# EAGLE schematic Boomchak (EAGLE 5.11)

## Sheet 1 of 3
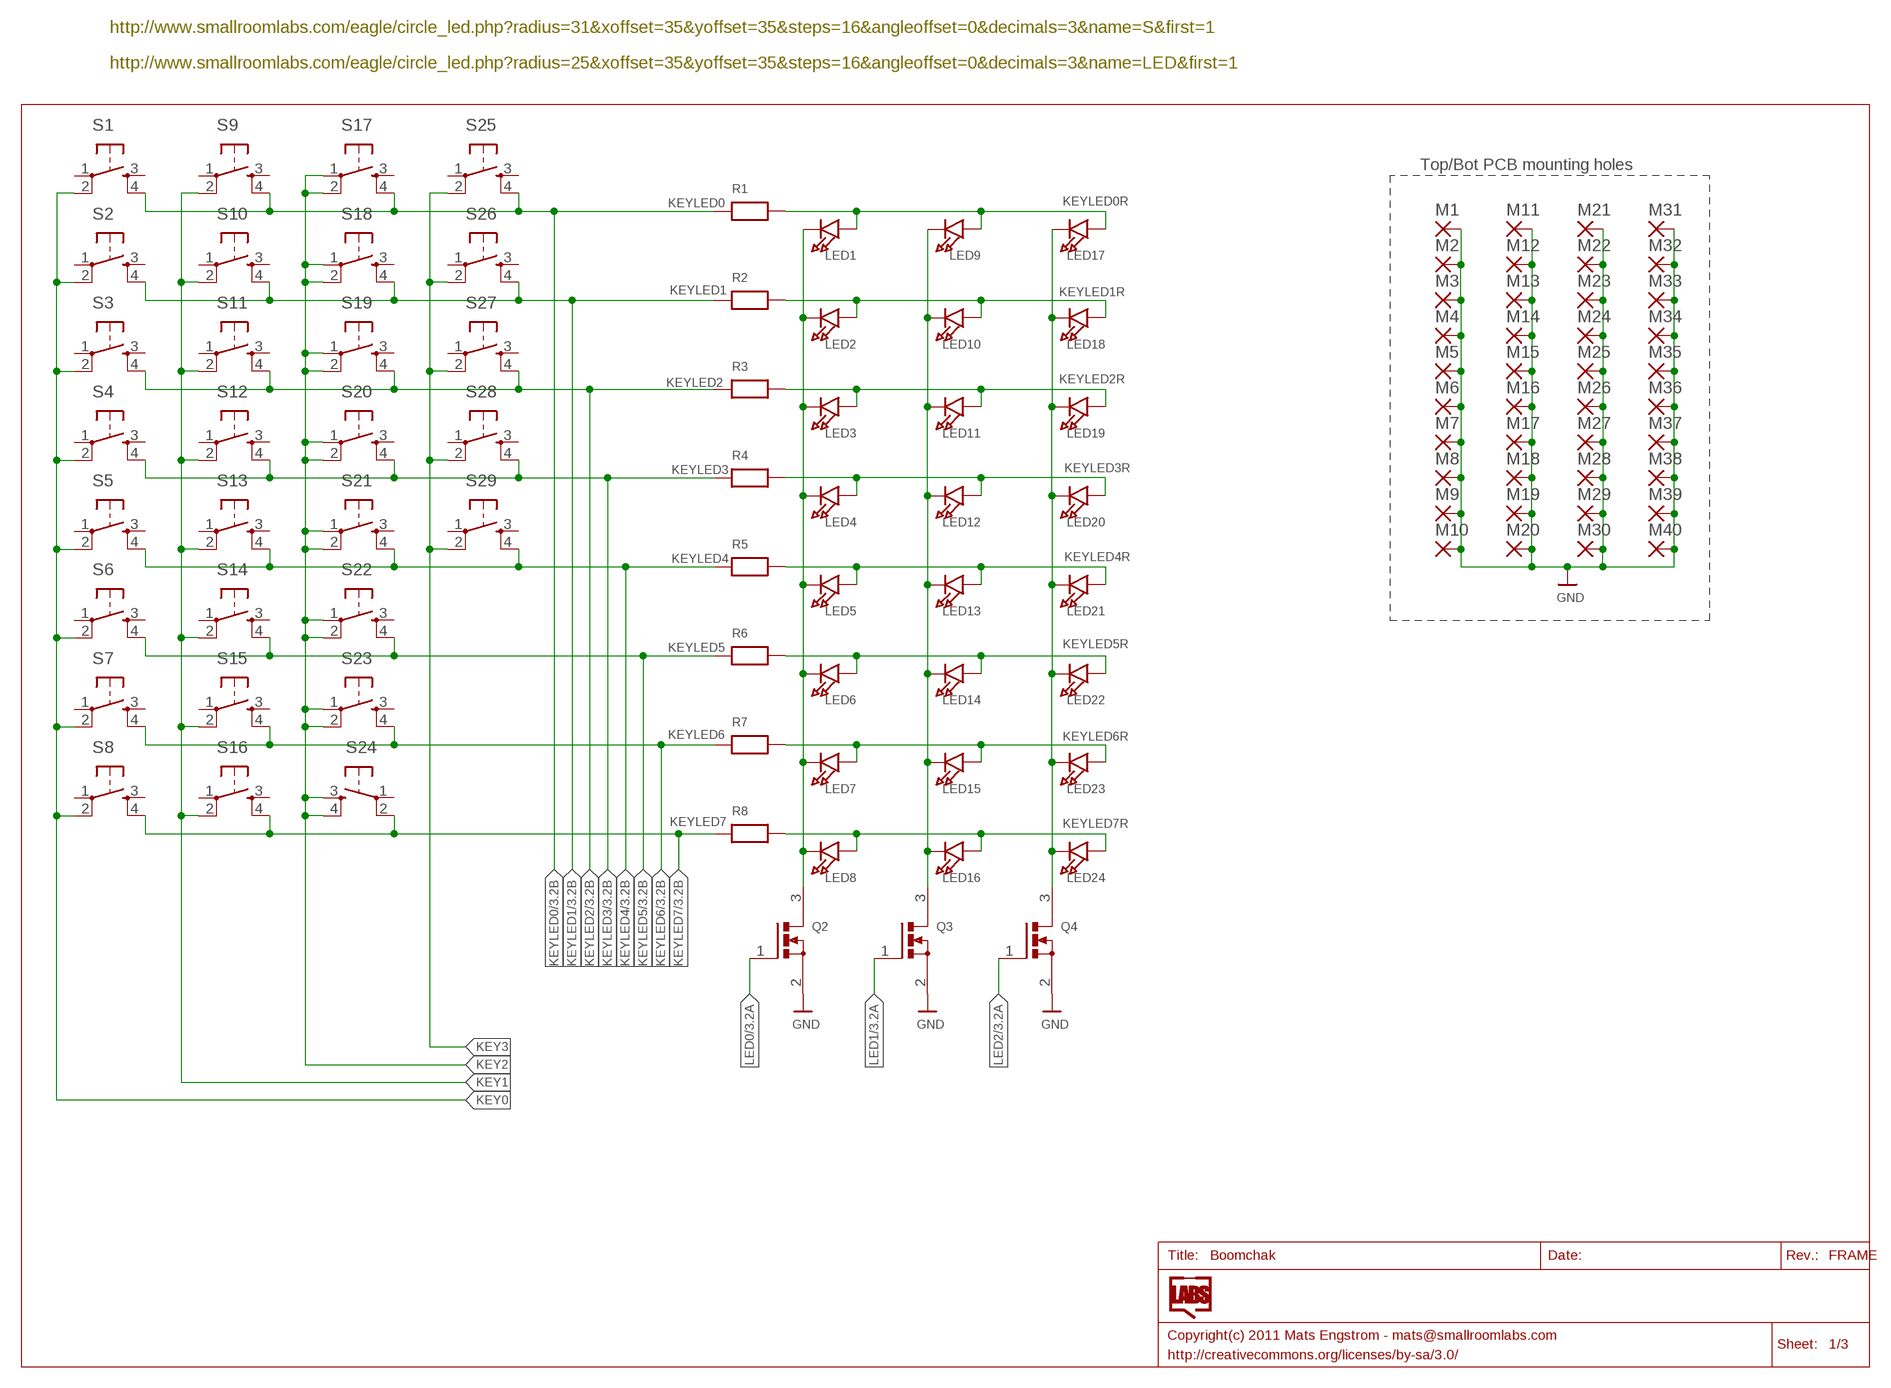
[diagram p0: schematic, sheet 1]

### Parts
LED1  LED0805  [CHIPLED_0805]
LED2  LED0805  [CHIPLED_0805]
LED3  LED0805  [CHIPLED_0805]
LED4  LED0805  [CHIPLED_0805]
LED5  LED0805  [CHIPLED_0805]
LED6  LED0805  [CHIPLED_0805]
LED7  LED0805  [CHIPLED_0805]
LED8  LED0805  [CHIPLED_0805]
LED9  LED0805  [CHIPLED_0805]
LED10  LED0805  [CHIPLED_0805]
LED11  LED0805  [CHIPLED_0805]
LED12  LED0805  [CHIPLED_0805]
LED13  LED0805  [CHIPLED_0805]
LED14  LED0805  [CHIPLED_0805]
LED15  LED0805  [CHIPLED_0805]
LED16  LED0805  [CHIPLED_0805]
LED17  LED0805  [CHIPLED_0805]
LED18  LED0805  [CHIPLED_0805]
LED19  LED0805  [CHIPLED_0805]
LED20  LED0805  [CHIPLED_0805]
LED21  LED0805  [CHIPLED_0805]
LED22  LED0805  [CHIPLED_0805]
LED23  LED0805  [CHIPLED_0805]
LED24  LED0805  [CHIPLED_0805]
M1  1,6/0,8  [1,6/0,8]
M2  1,6/0,8  [1,6/0,8]
M3  1,6/0,8  [1,6/0,8]
M4  1,6/0,8  [1,6/0,8]
M5  1,6/0,8  [1,6/0,8]
M6  1,6/0,8  [1,6/0,8]
M7  1,6/0,8  [1,6/0,8]
M8  1,6/0,8  [1,6/0,8]
M9  1,6/0,8  [1,6/0,8]
M10  1,6/0,8  [1,6/0,8]
M11  1,6/0,8  [1,6/0,8]
M12  1,6/0,8  [1,6/0,8]
M13  1,6/0,8  [1,6/0,8]
M14  1,6/0,8  [1,6/0,8]
M15  1,6/0,8  [1,6/0,8]
M16  1,6/0,8  [1,6/0,8]
M17  1,6/0,8  [1,6/0,8]
M18  1,6/0,8  [1,6/0,8]
M19  1,6/0,8  [1,6/0,8]
M20  1,6/0,8  [1,6/0,8]
M21  1,6/0,8  [1,6/0,8]
M22  1,6/0,8  [1,6/0,8]
M23  1,6/0,8  [1,6/0,8]
M24  1,6/0,8  [1,6/0,8]
M25  1,6/0,8  [1,6/0,8]
M26  1,6/0,8  [1,6/0,8]
M27  1,6/0,8  [1,6/0,8]
M28  1,6/0,8  [1,6/0,8]
M29  1,6/0,8  [1,6/0,8]
M30  1,6/0,8  [1,6/0,8]
M31  1,6/0,8  [1,6/0,8]
M32  1,6/0,8  [1,6/0,8]
M33  1,6/0,8  [1,6/0,8]
M34  1,6/0,8  [1,6/0,8]
M35  1,6/0,8  [1,6/0,8]
M36  1,6/0,8  [1,6/0,8]
M37  1,6/0,8  [1,6/0,8]
M38  1,6/0,8  [1,6/0,8]
M39  1,6/0,8  [1,6/0,8]
M40  1,6/0,8  [1,6/0,8]
Q2  MOSFET-NWAVE  [SOT23-W]
Q3  MOSFET-NWAVE  [SOT23-W]
Q4  MOSFET-NWAVE  [SOT23-W]
R1  RESISTOR0805  [0805]
R2  RESISTOR0805  [0805]
R3  RESISTOR0805  [0805]
R4  RESISTOR0805  [0805]
R5  RESISTOR0805  [0805]
R6  RESISTOR0805  [0805]
R7  RESISTOR0805  [0805]
R8  RESISTOR0805  [0805]
S1  TAC_SWITCHSMD  [TACTILE_SWITCH_SMD]
S2  TAC_SWITCHSMD  [TACTILE_SWITCH_SMD]
S3  TAC_SWITCHSMD  [TACTILE_SWITCH_SMD]
S4  TAC_SWITCHSMD  [TACTILE_SWITCH_SMD]
S5  TAC_SWITCHSMD  [TACTILE_SWITCH_SMD]
S6  TAC_SWITCHSMD  [TACTILE_SWITCH_SMD]
S7  TAC_SWITCHSMD  [TACTILE_SWITCH_SMD]
S8  TAC_SWITCHSMD  [TACTILE_SWITCH_SMD]
S9  TAC_SWITCHSMD  [TACTILE_SWITCH_SMD]
S10  TAC_SWITCHSMD  [TACTILE_SWITCH_SMD]
S11  TAC_SWITCHSMD  [TACTILE_SWITCH_SMD]
S12  TAC_SWITCHSMD  [TACTILE_SWITCH_SMD]
S13  TAC_SWITCHSMD  [TACTILE_SWITCH_SMD]
S14  TAC_SWITCHSMD  [TACTILE_SWITCH_SMD]
S15  TAC_SWITCHSMD  [TACTILE_SWITCH_SMD]
S16  TAC_SWITCHSMD  [TACTILE_SWITCH_SMD]
S17  TAC_SWITCHSMD  [TACTILE_SWITCH_SMD]
S18  TAC_SWITCHSMD  [TACTILE_SWITCH_SMD]
S19  TAC_SWITCHSMD  [TACTILE_SWITCH_SMD]
S20  TAC_SWITCHSMD  [TACTILE_SWITCH_SMD]
S21  TAC_SWITCHSMD  [TACTILE_SWITCH_SMD]
S22  TAC_SWITCHSMD  [TACTILE_SWITCH_SMD]
S23  TAC_SWITCHSMD  [TACTILE_SWITCH_SMD]
S24  TAC_SWITCHSMD  [TACTILE_SWITCH_SMD]
S25  TAC_SWITCHSMD  [TACTILE_SWITCH_SMD]
S26  TAC_SWITCHSMD  [TACTILE_SWITCH_SMD]
S27  TAC_SWITCHSMD  [TACTILE_SWITCH_SMD]
S28  TAC_SWITCHSMD  [TACTILE_SWITCH_SMD]
S29  TAC_SWITCHSMD  [TACTILE_SWITCH_SMD]

### Nets
GND: M1.1(P) M2.1(P) M3.1(P) M4.1(P) M5.1(P) M6.1(P) M7.1(P) M8.1(P) M9.1(P) M10.1(P) M11.1(P) M12.1(P) M13.1(P) M14.1(P) M15.1(P) M16.1(P) M17.1(P) M18.1(P) M19.1(P) M20.1(P) M21.1(P) M22.1(P) M23.1(P) M24.1(P) M25.1(P) M26.1(P) M27.1(P) M28.1(P) M29.1(P) M30.1(P) M31.1(P) M32.1(P) M33.1(P) M34.1(P) M35.1(P) M36.1(P) M37.1(P) M38.1(P) M39.1(P) M40.1(P) Q2.2(S) Q3.2(S) Q4.2(S) ; also sheet 2,3
KEY0: S1.2 S2.2 S3.2 S4.2 S5.2 S6.2 S7.2 S8.2
KEY1: S9.2 S10.2 S11.2 S12.2 S13.2 S14.2 S15.2 S16.2
KEY2: S17.1 S17.2 S18.1 S18.2 S19.1 S19.2 S20.1 S20.2 S21.1 S21.2 S22.1 S22.2 S23.1 S23.2 S24.3 S24.4
KEY3: S25.2 S26.2 S27.2 S28.2 S29.2
KEYLED0: R1.1 S1.4 S9.4 S17.4 S25.4 ; also sheet 3
KEYLED0R: LED1.A LED9.A LED17.A R1.2
KEYLED1: R2.1 S2.4 S10.4 S18.4 S26.4 ; also sheet 3
KEYLED1R: LED2.A LED10.A LED18.A R2.2
KEYLED2: R3.1 S3.4 S11.4 S19.4 S27.4 ; also sheet 3
KEYLED2R: LED3.A LED11.A LED19.A R3.2
KEYLED3: R4.1 S4.4 S12.4 S20.4 S28.4 ; also sheet 3
KEYLED3R: LED4.A LED12.A LED20.A R4.2
KEYLED4: R5.1 S5.4 S13.4 S21.4 S29.4 ; also sheet 3
KEYLED4R: LED5.A LED13.A LED21.A R5.2
KEYLED5: R6.1 S6.4 S14.4 S22.4 ; also sheet 3
KEYLED5R: LED6.A LED14.A LED22.A R6.2
KEYLED6: R7.1 S7.4 S15.4 S23.4 ; also sheet 3
KEYLED6R: LED7.A LED15.A LED23.A R7.2
KEYLED7: R8.1 S8.4 S16.4 S24.2 ; also sheet 3
KEYLED7R: LED8.A LED16.A LED24.A R8.2
LED0: Q2.1(G) ; also sheet 3
LED0A: LED1.C LED2.C LED3.C LED4.C LED5.C LED6.C LED7.C LED8.C Q2.3(D)
LED1: Q3.1(G) ; also sheet 3
LED1A: LED9.C LED10.C LED11.C LED12.C LED13.C LED14.C LED15.C LED16.C Q3.3(D)
LED2: Q4.1(G) ; also sheet 3
LED2A: LED17.C LED18.C LED19.C LED20.C LED21.C LED22.C LED23.C LED24.C Q4.3(D)
Unconnected: S1.1 S1.3 S2.1 S2.3 S3.1 S3.3 S4.1 S4.3 S5.1 S5.3 S6.1 S6.3 S7.1 S7.3 S8.1 S8.3 S9.1 S9.3 S10.1 S10.3 S11.1 S11.3 S12.1 S12.3 S13.1 S13.3 S14.1 S14.3 S15.1 S15.3 S16.1 S16.3 S17.3 S18.3 S19.3 S20.3 S21.3 S22.3 S23.3 S24.1 S25.1 S25.3 S26.1 S26.3 S27.1 S27.3 S28.1 S28.3 S29.1 S29.3

### Notes on the sheet
- http://www.smallroomlabs.com/eagle/circle_led.php?radius=31&xoffset=35&yoffset=35&steps=16&angleoffset=0&decimals=3&name=S&first=1
- http://www.smallroomlabs.com/eagle/circle_led.php?radius=25&xoffset=35&yoffset=35&steps=16&angleoffset=0&decimals=3&name=LED&first=1
- Top/Bot PCB mounting holes

## Sheet 2 of 3
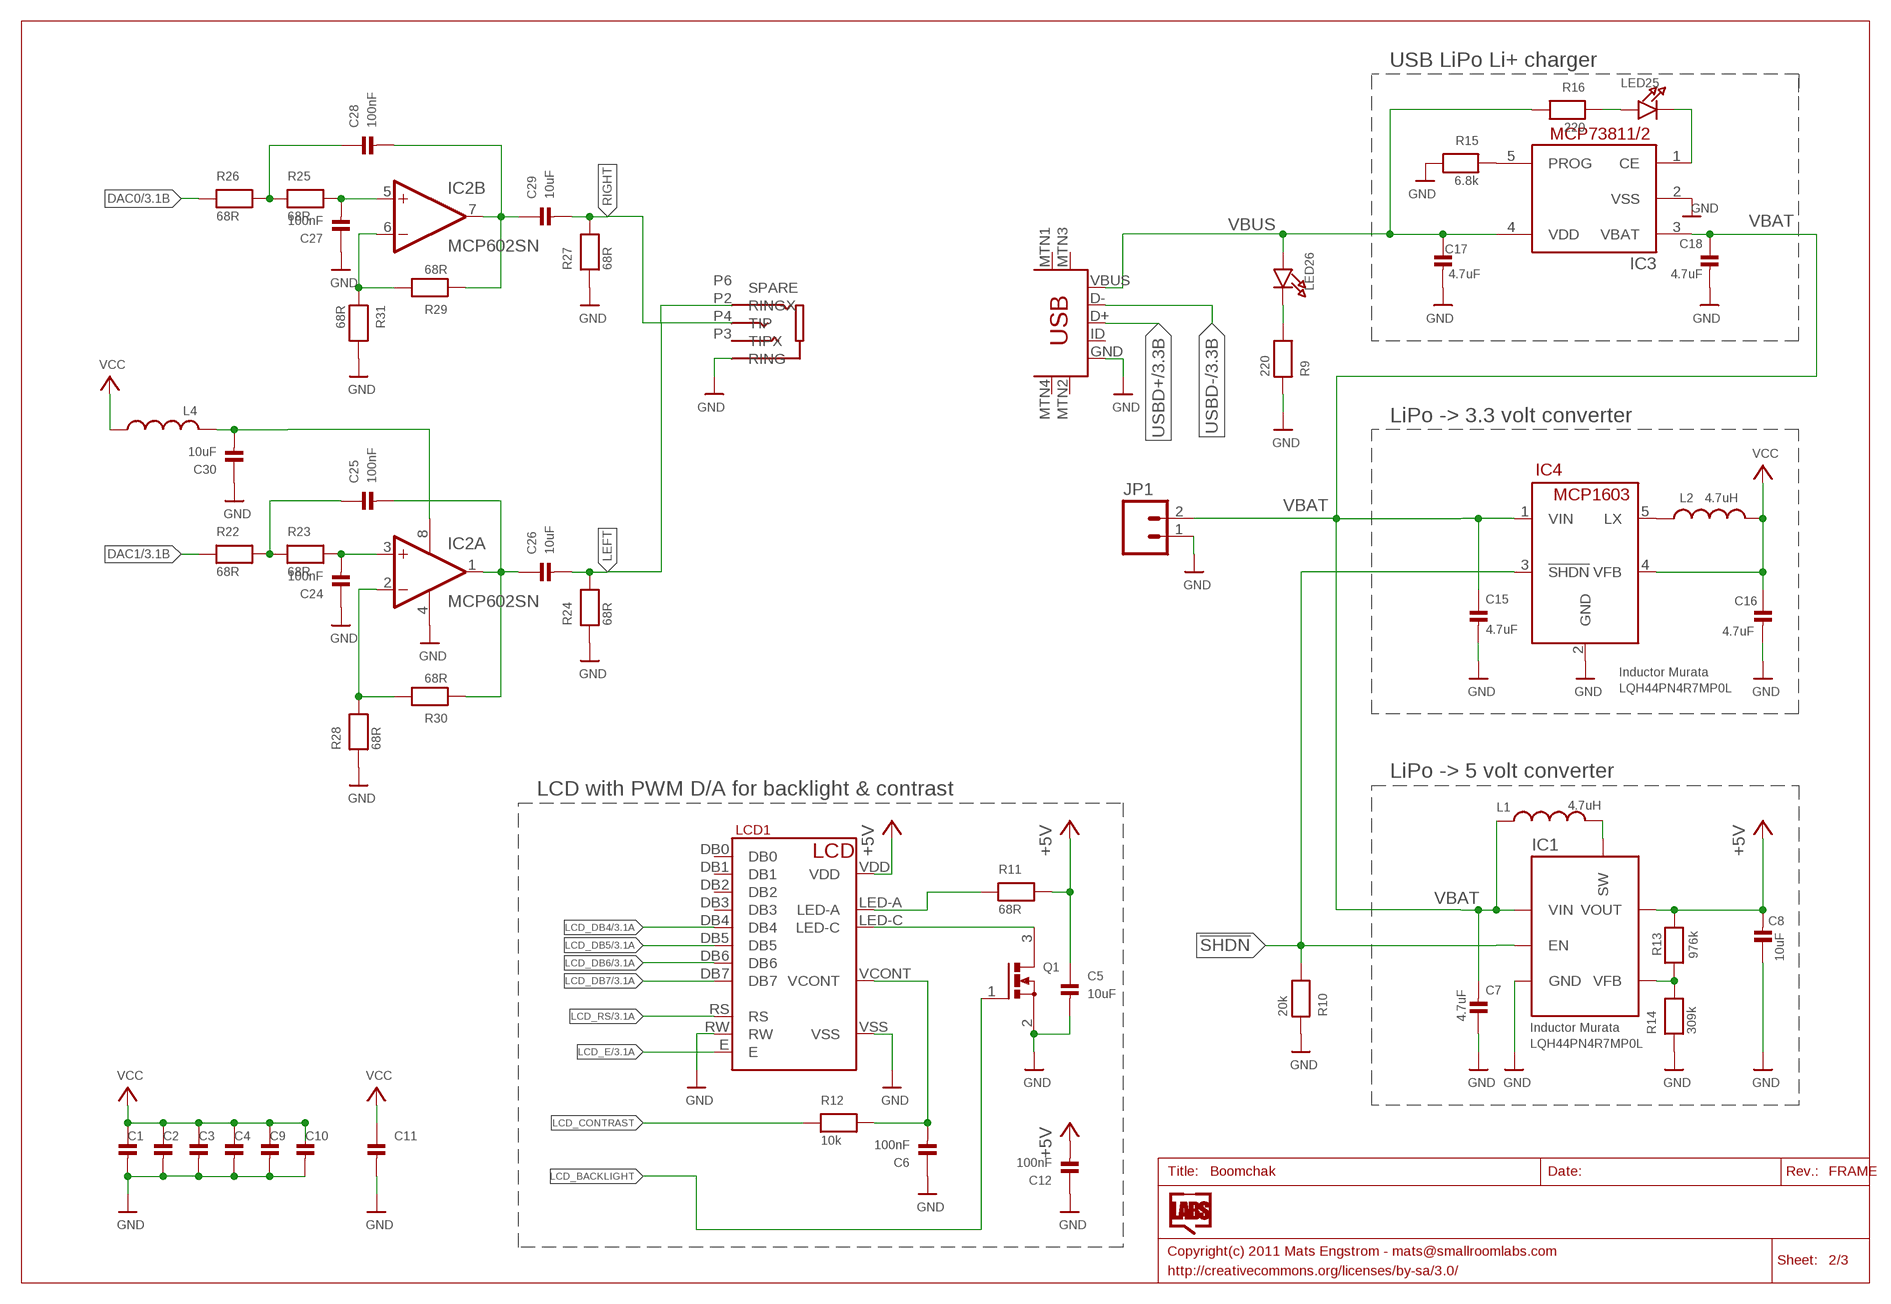
[diagram p1: schematic, sheet 2]

### Parts
C1  CAP_CERAMIC0805  [0805]
C2  CAP_CERAMIC0805  [0805]
C3  CAP_CERAMIC0805  [0805]
C4  CAP_CERAMIC0805  [0805]
C5  10uF  CAP_CERAMIC0805  [0805]
C6  100nF  CAP_CERAMIC0805  [0805]
C7  4.7uF  CAP_CERAMIC0805  [0805]
C8  10uF  CAP_CERAMIC0805  [0805]
C9  CAP_CERAMIC0805  [0805]
C10  CAP_CERAMIC0805  [0805]
C11  CAP_CERAMIC0805  [0805]
C12  100nF  CAP_CERAMIC0805  [0805]
C15  4.7uF  CAP_CERAMIC0805  [0805]
C16  4.7uF  CAP_CERAMIC0805  [0805]
C17  4.7uF  CAP_CERAMIC0805  [0805]
C18  4.7uF  CAP_CERAMIC0805  [0805]
C24  100nF  CAP_CERAMIC0805  [0805]
C25  100nF  CAP_CERAMIC0805  [0805]
C26  10uF  CAP_CERAMIC0805  [0805]
C27  100nF  CAP_CERAMIC0805  [0805]
C28  100nF  CAP_CERAMIC0805  [0805]
C29  10uF  CAP_CERAMIC0805  [0805]
C30  10uF  CAP_CERAMIC0805  [0805]
IC1  MCP1640  MCP1640SOT23-6  [SOT23-6]
IC2  MCP602SN  [SO08]
IC3  MCP73811/2  [SOT23-5L]
IC4  MCP1603  [SOT23-5L]
JP1  M02-JST-2MM-SMT  [JST-2-SMD]
L1  4.7uH  INDUCTOR-1515  [IND1515]
L2  4.7uH  INDUCTOR-1515  [IND1515]
L4  22R  INDUCTOR0805  [0805]
LCD1  LCD_1X8  [RT082A]
LED25  LED0805  [CHIPLED_0805]
LED26  LED0805  [CHIPLED_0805]
Q1  MOSFET-NWAVE  [SOT23-W]
R9  220  RESISTOR0805  [0805]
R10  20k  RESISTOR0805  [0805]
R11  68R  RESISTOR1206  [1206]
R12  10k  RESISTOR0805  [0805]
R13  976k  RESISTOR0805  [0805]
R14  309k  RESISTOR0805  [0805]
R15  6.8k  RESISTOR0805  [0805]
R16  220  RESISTOR0805  [0805]
R22  68R  RESISTOR1206  [1206]
R23  68R  RESISTOR1206  [1206]
R24  68R  RESISTOR1206  [1206]
R25  68R  RESISTOR1206  [1206]
R26  68R  RESISTOR1206  [1206]
R27  68R  RESISTOR1206  [1206]
R28  68R  RESISTOR1206  [1206]
R29  68R  RESISTOR1206  [1206]
R30  68R  RESISTOR1206  [1206]
R31  68R  RESISTOR1206  [1206]
U$4  JACK4-PJ320  [PJ-320E]
USB  USB-MINIB-5PIN  [USB-MINIB]

### Nets
!SHDN: IC1.3(EN) IC4.3(!SHDN) R10.2
+5V: C5.1 C8.2 C12.2 IC1.5(VOUT) LCD1.VDD R11.2 R13.1
CHRG_A: LED25.A R16.1
CHRG_C: IC3.1(CE) LED25.C
DAC0: R26.1 ; also sheet 3
DAC1: R22.1 ; also sheet 3
GND: C1.2 C2.2 C3.2 C4.2 C5.2 C6.1 C7.1 C8.1 C9.2 C10.2 C11.2 C12.1 C15.2 C16.2 C17.2 C18.2 C24.1 C27.1 C30.1 IC1.2(GND) IC2.4(P:V-) IC3.2(VSS) IC4.2(GND) JP1.1 LCD1.RW LCD1.VSS Q1.2(S) R9.1 R10.1 R14.1 R15.2 R24.1 R27.1 R28.1 R31.2 U$4.P5(RING) USB.GND ; also sheet 1,3
LCD_BACKLIGHT: Q1.1(G)
LCD_C: LCD1.LED-C Q1.3(D)
LCD_CONTRAST: R12.1
LCD_DB4: LCD1.DB4 ; also sheet 3
LCD_DB5: LCD1.DB5 ; also sheet 3
LCD_DB6: LCD1.DB6 ; also sheet 3
LCD_DB7: LCD1.DB7 ; also sheet 3
LCD_E: LCD1.E ; also sheet 3
LCD_RS: LCD1.RS ; also sheet 3
LEFT: C26.2 R24.2 U$4.P2(RINGX)
N$1: LCD1.LED-A R11.1
N$2: IC1.4(VFB) R13.2 R14.2
N$3: IC3.5(PROG) R15.1
N$8: IC1.1(SW) L1.P$2
N$12: IC4.5(LX) L2.P$1
N$14: C25.1 R22.2 R23.1
N$15: C24.2 IC2.3(A:+IN) R23.2
N$16: C25.2 C26.1 IC2.1(A:OUT) R30.1
N$17: C28.1 R25.1 R26.2
N$18: C27.2 IC2.5(B:+IN) R25.2
N$22: C28.2 C29.1 IC2.7(B:OUT) R29.1
N$23: IC2.6(B:-IN) R29.2 R31.1
N$24: IC2.2(A:-IN) R28.2 R30.2
N$25: C30.2 IC2.8(P:V+) L4.2
POW_C: LED26.C R9.2
RIGHT: C29.2 R27.2 U$4.P4(TIP)
USBD+: USB.D+ ; also sheet 3
USBD-: USB.D- ; also sheet 3
VBAT: C7.2 C15.1 C18.1 IC1.6(VIN) IC3.3(VBAT) IC4.1(VIN) JP1.2 L1.P$1
VBUS: C17.1 IC3.4(VDD) LED26.A R16.2 USB.VBUS ; also sheet 3
VCC: C1.1 C2.1 C3.1 C4.1 C9.1 C10.1 C11.1 C16.1 IC4.4(VFB) L2.P$2 L4.1 ; also sheet 3
VCONT: C6.2 LCD1.VCONT R12.2
Unconnected: LCD1.DB0 LCD1.DB1 LCD1.DB2 LCD1.DB3 U$4.P3(TIPX) U$4.P6(SPARE) USB.ID USB.MTN1(MTN2) USB.MTN2(MTN3) USB.MTN3(MTN1) USB.MTN4

### Notes on the sheet
- USB LiPo Li+ charger
- LiPo -> 3.3 volt converter
- Inductor Murata
- LQH44PN4R7MP0L
- LiPo -> 5 volt converter
- LCD with PWM D/A for backlight & contrast
- Inductor Murata
- LQH44PN4R7MP0L

## Sheet 3 of 3
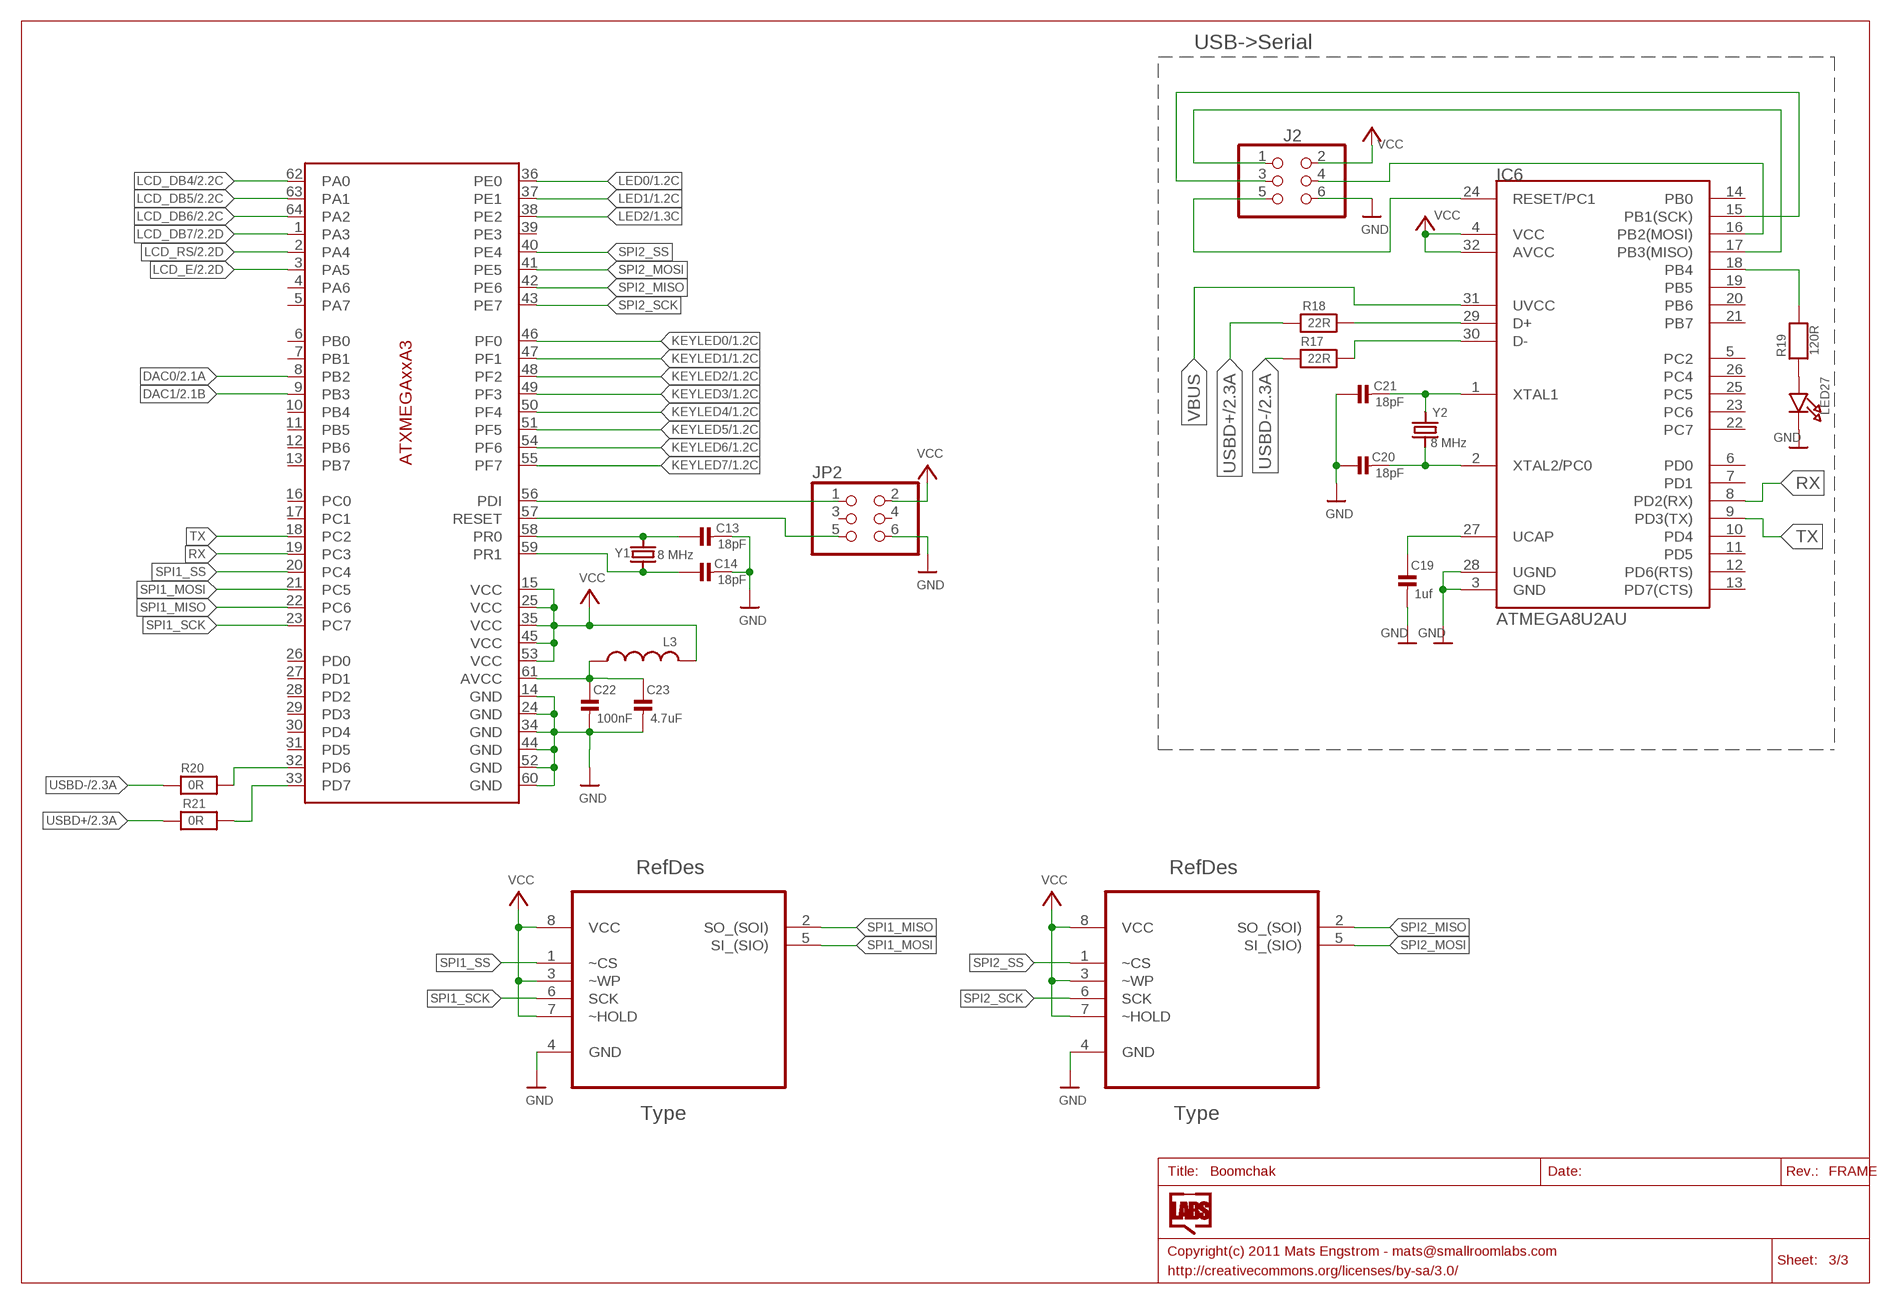
[diagram p2: schematic, sheet 3]

### Parts
C13  18pF  CAP_CERAMIC0805  [0805]
C14  18pF  CAP_CERAMIC0805  [0805]
C19  1uf  CAP_CERAMIC0805  [0805]
C20  18pF  CAP_CERAMIC0805  [0805]
C21  18pF  CAP_CERAMIC0805  [0805]
C22  100nF  CAP_CERAMIC0805  [0805]
C23  4.7uF  CAP_CERAMIC0805  [0805]
IC5  ATXMEGA64A3U  ATXMEGA64A3  [TQFP64]
IC6  ATMEGA8U2AU  [TQFP32-08]
IC7  AT25DF161-SH-B  [SOIC127P798X216-8N]
IC8  AT25DF161-SH-B  [SOIC127P798X216-8N]
J2  AVR_SPI_PRG_6OFFSET_PADS  PINHD-2X3  [2X03]
JP2  PINHD-2X3  [2X03]
L3  22R  INDUCTOR0805  [0805]
LED27  LED0805  [CHIPLED_0805]
R17  22R  RESISTOR0805  [0805]
R18  22R  RESISTOR0805  [0805]
R19  120R  RESISTOR0805  [0805]
R20  0R  RESISTOR0805  [0805]
R21  0R  RESISTOR0805  [0805]
Y1  8 MHz  CRYSTALSMD  [HC49UP]
Y2  8 MHz  CRYSTALSMD  [HC49UP]

### Nets
A3U_D+: IC5.33(PD7) R21.2
A3U_D-: IC5.32(PD6) R20.2
A3U_PDI: IC5.56(PDI) JP2.1
A3U_PDI-CLK: IC5.57(RESET) JP2.5
A3U_XTAL1: C13.1 IC5.58(PR0) Y1.2
A3U_XTAL2: C14.1 IC5.59(PR1) Y1.1
AVCC: C22.1 C23.1 IC5.61(AVCC) L3.1
DAC0: IC5.8(PB2) ; also sheet 2
DAC1: IC5.9(PB3) ; also sheet 2
GND: C13.2 C14.2 C19.2 C20.1 C21.1 C22.2 C23.2 IC5.14(GND) IC5.24(GND) IC5.34(GND) IC5.44(GND) IC5.52(GND) IC5.60(GND) IC6.3(GND) IC6.28(UGND) IC7.4(GND) IC8.4(GND) J2.6 JP2.6 LED27.C ; also sheet 1,2
KEYLED0: IC5.46(PF0) ; also sheet 1
KEYLED1: IC5.47(PF1) ; also sheet 1
KEYLED2: IC5.48(PF2) ; also sheet 1
KEYLED3: IC5.49(PF3) ; also sheet 1
KEYLED4: IC5.50(PF4) ; also sheet 1
KEYLED5: IC5.51(PF5) ; also sheet 1
KEYLED6: IC5.54(PF6) ; also sheet 1
KEYLED7: IC5.55(PF7) ; also sheet 1
LCD_DB4: IC5.62(PA0) ; also sheet 2
LCD_DB5: IC5.63(PA1) ; also sheet 2
LCD_DB6: IC5.64(PA2) ; also sheet 2
LCD_DB7: IC5.1(PA3) ; also sheet 2
LCD_E: IC5.3(PA5) ; also sheet 2
LCD_RS: IC5.2(PA4) ; also sheet 2
LED0: IC5.36(PE0) ; also sheet 1
LED1: IC5.37(PE1) ; also sheet 1
LED2: IC5.38(PE2) ; also sheet 1
N$4: C19.1 IC6.27(UCAP)
N$5: IC6.16(PB2(MOSI)) J2.4
N$6: IC6.17(PB3(MISO)) J2.1
N$7: IC6.18(PB4) R19.2
N$9: C21.2 IC6.1(XTAL1) Y2.2
N$10: IC6.15(PB1(SCK)) J2.3
N$11: IC6.24(RESET/PC1) J2.5
N$13: LED27.A R19.1
N$19: C20.2 IC6.2(XTAL2/PC0) Y2.1
N$20: IC6.30(D-) R17.2
N$21: IC6.29(D+) R18.2
RX: IC5.19(PC3) IC6.8(PD2(RX))
SPI1_MISO: IC5.22(PC6) IC7.2(SO_(SOI))
SPI1_MOSI: IC5.21(PC5) IC7.5(SI_(SIO))
SPI1_SCK: IC5.23(PC7) IC7.6(SCK)
SPI1_SS: IC5.20(PC4) IC7.1(~CS)
SPI2_MISO: IC5.42(PE6) IC8.2(SO_(SOI))
SPI2_MOSI: IC5.41(PE5) IC8.5(SI_(SIO))
SPI2_SCK: IC5.43(PE7) IC8.6(SCK)
SPI2_SS: IC5.40(PE4) IC8.1(~CS)
TX: IC5.18(PC2) IC6.9(PD3(TX))
USBD+: R18.1 R21.1 ; also sheet 2
USBD-: R17.1 R20.1 ; also sheet 2
VBUS: IC6.31(UVCC) ; also sheet 2
VCC: IC5.15(VCC) IC5.25(VCC) IC5.35(VCC) IC5.45(VCC) IC5.53(VCC) IC6.4(VCC) IC6.32(AVCC) IC7.3(~WP) IC7.7(~HOLD) IC7.8(VCC) IC8.3(~WP) IC8.7(~HOLD) IC8.8(VCC) J2.2 JP2.2 L3.2 ; also sheet 2
Unconnected: IC5.4(PA6) IC5.5(PA7) IC5.6(PB0) IC5.7(PB1) IC5.10(PB4) IC5.11(PB5) IC5.12(PB6) IC5.13(PB7) IC5.16(PC0) IC5.17(PC1) IC5.26(PD0) IC5.27(PD1) IC5.28(PD2) IC5.29(PD3) IC5.30(PD4) IC5.31(PD5) IC5.39(PE3) IC6.5(PC2) IC6.6(PD0) IC6.7(PD1) IC6.10(PD4) IC6.11(PD5) IC6.12(PD6(RTS)) IC6.13(PD7(CTS)) IC6.14(PB0) IC6.19(PB5) IC6.20(PB6) IC6.21(PB7) IC6.22(PC7) IC6.23(PC6) IC6.25(PC5) IC6.26(PC4) JP2.3 JP2.4

### Notes on the sheet
- USB->Serial

## Library data of the parts
C1-C30 = microbuilder:CAP_CERAMIC: Ceramic Capacitors 0402 - 0402 Surface Mount Capacitors 0.1uF 10V 10% [Digikey: 490-1318-2-ND] 0603 - 0603 Surface Mount Capacitors 16 pF 50V 5% [Digikey: 445-5051-2-ND] 22 pF 50V [Digikey: PCC220ACVTR-ND] 33 pF 50V 5% [Digikey: 490-1415-1-ND] 56pF 50V 5% [Digikey: 490-1421-1-ND] 220pF 50V 5% [Digikey: 445-1285-1-ND] 680 pF 50V 2200 pF 50V 5% C0G [Digikey: 445-1297-1-ND] 5600 pF 100V 5% X7R [Digikey: 478-3711-1-ND] 0.1 µF 25V 10% [Digikey: PCC2277TR-ND] 0.22 µF 16V 10% X7R [Digikey: 445-1318-1-ND] 1.0 µF 25V 10% [Digikey: 445-5146-2-ND] 0603 - RF Specific 3pF 250V +/-0.1pF RF [Digikey: 712-1347-1-ND] 18 pF 250V 5% [Digikey: 478-3505-1-ND or 712-1322-1-ND] 56 pF 250V 5% C0G RF [Digikey: 490-4867-1-ND] 68 pF 250V RF [Digikey: 490-4868-1-ND] 0805 - 0805 Surface Mount Capacitors 220 pF 250V 2% RF Ceramic Capacitor [Digikey: 712-1398-1-ND] 1000 pF 50V 2% NP0 Ceramic Capacitor [Digikey: 478-3760-1-ND] 0.1 µF 25V 10% Ceramic Capacitor [Digikey: PCC1828TR-ND] 1.0 µF 16V 10% Ceramic Capacitor[Digikey: 490-1691-2-ND] 10.0 µF 10V 10% Ceramic Capacitor[Digikey: 709-1228-1-ND] 1206 - 1206 Surface Mount Capacitors
IC1 = SmallRoomLabs:MCP1640
IC2 = linear:MCP602: Single Op Amp 2.7V to 6.0V Single Supply CMOS Source: http://ww1.microchip.com/downloads/en/DeviceDoc/21314g.pdf
IC3 = adafruit:MCP73811/2: MCP73811 and MCP73812 Simple, Miniature Single-Cell, Fully Integrated Li-Ion / Li-Polymer Charge Management Controllers SOT-23-5 package, no indicator LED but with adjustable current, small and very inexpensive
IC4 = SmallRoomLabs:MCP1603
IC5 = SmallRoomLabs:ATXMEGA64A3
IC6 = SparkFun:ATMEGA8U2: Atmel 8-bit Microcontroller with 8/16/32K Bystes of ISP Flash and USB Controller. ATmega8U2, ATmega16U2, and ATmega32U2
IC7 IC8 = SmallRoomLabs:AT25DF161-SH-B; DESCRIPTION: 16-megabit Minimum SPI Serial Flash Memory; MPN: AT25DF161-SH-B; OC_FARNELL: 1715442; OC_NEWARK: 15R0307; PACKAGE: SOIC-8; SUPPLIER: Atmel
J2 JP2 = SparkFun:PINHD-2X3: PIN HEADER
JP1 = SparkFun:M02: Header 2 Standard 2-pin 0.1" header. Use with straight break away headers (SKU : PRT-00116), right angle break away headers (PRT-00553), swiss pins (PRT-00743), machine pins (PRT-00117), and female headers (PRT-00115). Molex polarized connector foot print use with SKU : PRT-08233 with associated crimp pins and housings.
L1 L2 = SmallRoomLabs:INDUCTOR
L3 L4 = microbuilder:INDUCTOR: Inductors 0603: 10nH Ceramic Inductor - microwire antenna/RF (Digikey: 712-1434-2-ND) 0805: 560nH Ceramic Inductor - RF (Digikey: 553-1047-1-ND) 1007 (2518 Metric) SMT: 10µH 10% 250mOhm 820mA 1007 Inductor (Digikey: 587-2189-1-ND) 22µH 10% 500mOhm 580mA 1007 Inductor (Digikey: 587-2190-1-ND) 47µH 10% 950mOhm 420mA 1007 Inductor (Digikey: 587-2191-1-ND) 47µH 5% 100mOhm 1A 1008 Inductor (Digikey: 732-1816-1-ND)
LCD1 = SmallRoomLabs:LCD
LED1-LED27 = microbuilder:LED: LED 0603 - 0603 Surface Mount Package Green LED - Low Power (3.9mcd, 2ma, 1.7Vf) Orange LED - Low Power (9.8mcd, 2ma, 1.8Vf) Red LED - Low Power (5mcd, 2ma, 1.8Vf) Yellow LED - Low Power (7mcd, 2ma, 1.8Vf) 0805 - 0805 Surface Mount Package 20mA: Red LED (104mcd, 20mA, Diffused) - LS R976 [Digikey: 475-1278-6-ND] Red LED (12mcd, 20mA, 2.0Vf, Clear) - APT2012EC [Digikey: 754-1128-1-ND] Green LED (15mcd, 20mA, 2.2Vf, Clear) - APT2012GC [Digikey: 754-1131-1-ND] Orange LED (160mcd, 20mA, 2.1Vf, Clear) - APT2012SECK [Digikey: 754-1130-1-ND] 2mA: Red LED (8.8mcd, 2mA, 1.8Vf, Clear) - Low Power [Digikey: 475-2510-1-ND] Green LED (5mcd, 2mA, 1.8Vf, Clear) - Low Power [Digikey: 475-2730-1-ND] Yellow LED (11.3mcd, 2mA, 1.8Vf, Clear) - Low Power [Digikey: 475-2555-1-ND] 1206 - 1206 Surface Mount Package Green LED (26mcd, 20mA, Diffused) - LG N971 [Digikey: 475-1407-6-ND] Red LED (15mcd, 20mA, Diffused) - LH N974 [Digikey: 475-1416-6-ND]
M1-M40 = wirepad:1,6/0,8: THROUGH-HOLE PAD
Q1-Q4 = microbuilder:MOSFET-N: N-Channel Mosfet Digikey: 2N7002ET1GOSTR-ND
R1-R31 = microbuilder:RESISTOR: Resistors 0402 - 0402 Surface Mount Package 10.0K 1% 1/16W [Digikey: 311-10.0KLRTR-ND] 0603 - 0603 Surface Mount Package 0 Ohm 1/10 Watt 1% Resistor 15 Ohm 1/10 Watt 1% Resistor 33 Ohm 1/10 Watt 1% Resistor 49.9 Ohm 1/10 Watt 1% Resistor 100 Ohm 1/10 Watt 1% Resistor 150 Ohm 1/10 Watt 1% Resistor 240 Ohm 1/10 Watt 1% Resistor 390 Ohm 1/10 Watt 1% Resistor 560 Ohm 1/10 Watt 1% Resistor 750 Ohm 1/10 Watt 1% Resistor 1.0K Ohm 1/10 Watt 1% Resistor 1.5K Ohm 1/10 Watt 1% Resistor 2.0K Ohm 1/10 Watt 1% Resistor 4.7K Ohm 1/10 Watt 1% Resistor 10.0K Ohm 1/10 Watt 1% Resistor 20.0K Ohm 1/10 Watt 1% Resistor 33.0K Ohm 1/10 Watt 1% Resistor 100.0K Ohm 1/10 Watt 1% Resistor 0805 - 0805 Surface Mount Package 0 Ohm 1/8 Watt 1% Resistor 33 Ohm 1/8 Watt 1% Resistor 100 Ohm 1/8 Watt 1% Resistor 150 Ohm 1/8 Watt 1% Resistor 200 Ohm 1/8 Watt 1% Resistor 240 Ohm 1/8 Watt 1% Resistor 330 Ohm 1/8 Watt 1% Resistor 390 Ohm 1/8 Watt 1% Resistor 470 Ohm 1/8 Watt 1% Resistor 1.0K Ohm 1/8 Watt 1% Resistor 1.5K Ohm 1/8 Watt 1% Resistor 2.0K Ohm 1/8 Watt 1% Resistor 4.7K Ohm 1/8 Watt 1% Resistor 5.1K Ohm 1/8 Watt 1% Resistor 5.6K Ohm 1/8 Watt 1% Resistor 10.0K Ohm 1/8 Watt 1% Resistor 22.0K Ohm 1/8 Watt 1% Resistor 33.0K Ohm 1/8 Watt 1% Resistor 100K Ohm 1/8 Watt 1% Resistor 1206 - 1206 Surface Mount Package
S1-S29 = SparkFun:TAC_SWITCH: Momentary Switch Button commonly used for reset or general input. Spark Fun Electronics SKU : COM-00097
U$4 = SmallRoomLabs:JACK4
USB = SparkFun:USB-MINIB: Mini-USB "B" connector with 5th pin broken out. Created new symbol breaking out 5th "ID" pin in mini/micro USB connector spec. See: http://en.wikipedia.org/wiki/Mini_usb#Cables. Uses same footprint as 4-pin symbol. Also added pins to connect to mounting / shield pads if required (probably not generally needed as signals aren't shielded once they leave the connector).
Y1 Y2 = microbuilder:CRYSTAL: Crystals HC49UP - Surface Mount Crystal 4.0MHz 18pF +/-30ppm Surface Mount Crystal [Digikey: 535-9857-1-ND] 12.0 MHz Surface Mount Crystal [Digikey: 535-9869-6-ND] 25.0 MHz Surface Mount Crystal [Digikey: 535-9078-1-ND] 3.2 x 2.5mm - MEMs SMT Crystal 12.0 MHz 8pF 15ppm 3.2 x 2.5mm Crystal [Digikey: 644-1047-1-ND] 16.0 MHz 8pF 15ppm 3.2 x 2.5mm Crystal [Digikey: 644-1049-1-ND] 16.0 MHz 10pF 10ppm 3.2 x 2.5mm Crystal [Digikey: 644-1100-1-ND] 27.12 MHz 18pF 30ppm 3.2 x 2.5mm Crystal [Digikey: 887-1424-1-ND] 4.9 x 1.8mm - MEMs SMT Crystal 32.768 KHz 12.5pF 20ppm 4.9 x 1.8mm Crystal [Digikey: SE2415CT-ND] Cylinder 32.768KHz Cylinder Crystal